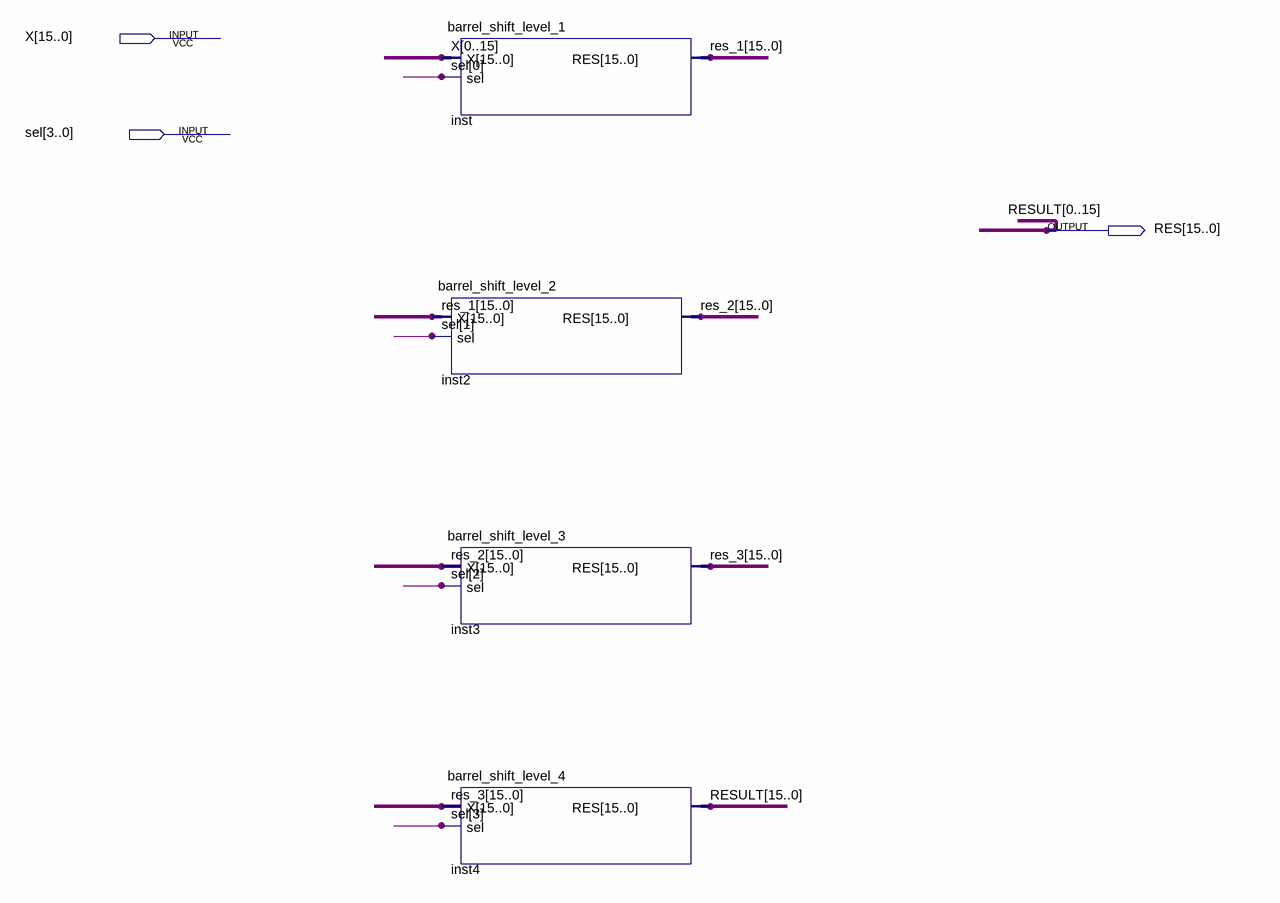
[diagram p0: schematic sheet]
// Quartus schematic shift_left.bdf as structural Verilog: 4 symbols, 3 pins
module shift_left (
  input  [15:0] X,
  input  [3:0] sel,
  output [15:0] RES
);

  wire [15:0] res_1, res_2, res_3;

  barrel_shift_level_1 inst (
    .X({X[0], X[1], X[2], X[3], X[4], X[5], X[6], X[7], X[8], X[9], X[10], X[11], X[12], X[13], X[14], X[15]}),
    .sel(sel[0]), .RES(res_1));
  barrel_shift_level_2 inst2 (.X(res_1), .sel(sel[1]), .RES(res_2));
  barrel_shift_level_3 inst3 (.X(res_2), .sel(sel[2]), .RES(res_3));
  barrel_shift_level_4 inst4 (
    .X(res_3), .sel(sel[3]),
    .RES({RES[0], RES[1], RES[2], RES[3], RES[4], RES[5], RES[6], RES[7], RES[8], RES[9], RES[10], RES[11], RES[12], RES[13], RES[14], RES[15]}));

  // Other names for the same wires on the sheet: RESULT[15:0] = {RES[0], RES[1], RES[2], RES[3], RES[4], RES[5], RES[6], RES[7], RES[8], RES[9], RES[10], RES[11], RES[12], RES[13], RES[14], RES[15]}
endmodule
